# Altium schematic sheet SIM800A.SchDoc
size A4; SheetNumber: 3; SheetTotal: 6
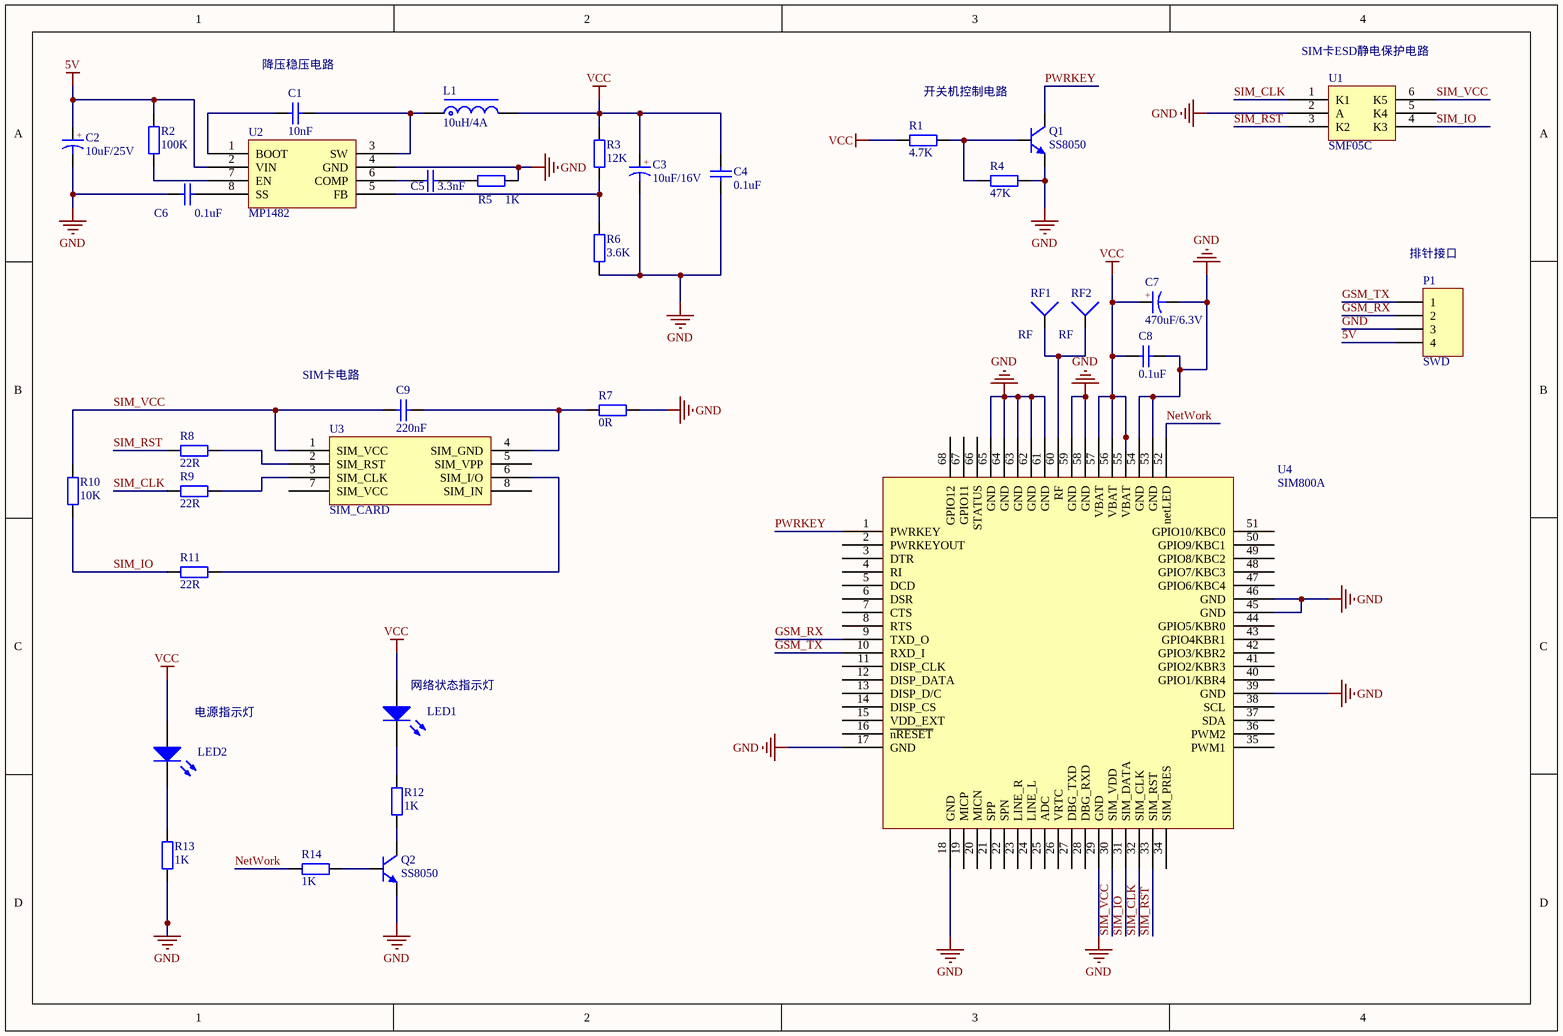
[diagram p0: SIM800A.SchDoc]

## Parts
C1  10nF  [C0805_L]
C2  10uF/25V  [CE-1.5*4*8]
C3  10uF/16V  [CE-1.5*4*8]
C4  0.1uF  [C0805_L]
C5  3.3nF  [C0805_L]
C6  0.1uF  [C0805_L]
C7  470uF/6.3V  [CE-1.5*4*8]
C8  0.1uF  [C0805_L]
C9  220nF  [C0805_L]
L1  10uH/4A  [LMR135]
LED1  红色  [LED0805_G]  (value not drawn)
LED2  红色  [LED0805_G]  (value not drawn)
P1  SWD  [HDR1X4]
Q1  SS8050  [TO92A]
Q2  SS8050  [TO92A]
R1  4.7K  [R0805_L]
R2  100K  [R0805_L]
R3  12K  [R0805_L]
R4  47K  [R0805_L]
R5  1K  [R0805_L]
R6  3.6K  [R0805_L]
R7  0R  [R0805_L]
R8  22R  [R0805_L]
R9  22R  [R0805_L]
R10  10K  [R0805_L]
R11  22R  [R0805_L]
R12  1K  [R0805_L]
R13  1K  [R0805_L]
R14  1K  [R0805_L]
RF1  RF
RF2  RF
U1  SMF05C
U2  MP1482
U3  SIM_CARD
U4  SIM800A

## Nets
5V: C2.1 P1.4 R2.2 U2.2(VIN)
GND: C2.2 C3.2 C4.1 C6.1 C7.2 C8.2 P1.3 Q1.1(E) Q2.1(E) R4.1 R5.2 R6.1 R7.1 R13.1 U1.2(A) U2.4(GND) U4.17(GND) U4.18(GND) U4.29(GND) U4.39(GND) U4.45(GND) U4.46(GND) U4.53(GND) U4.54(GND) U4.58(GND) U4.59(GND) U4.61(GND) U4.62(GND) U4.63(GND) U4.64(GND) U4.65(GND)
VCC: C3.1 C4.2 C7.1 C8.1 L1.2 LED1.1(A) LED2.1(A) R1.2 R3.2 U4.55(VBAT) U4.56(VBAT) U4.57(VBAT)
GSM_RX: P1.2 U4.9(TXD_O)
GSM_TX: P1.1 U4.10(RXD_I)
NetWork: R14.2 U4.52(netLED)
PWRKEY: Q1.3(C) U4.1(PWRKEY)
SIM_CLK: R9.2 U1.1(K1) U4.32(SIM_CLK)
SIM_IO: R10.2 R11.2 U1.4(K3) U4.31(SIM_DATA)
SIM_RST: R8.2 U1.3(K2) U4.33(SIM_RST)
SIM_VCC: C9.2 R10.1 U1.6(K5) U3.1(SIM_VCC) U4.30(SIM_VDD)
NetC1_1: C1.1 U2.1(BOOT)
NetC1_2: C1.2 L1.1 U2.3(SW)
NetC5_1: C5.1 U2.6(COMP)
NetC5_2: C5.2 R5.1
NetC6_2: C6.2 U2.8(SS)
NetC9_1: C9.1 R7.2 U3.4(SIM_GND)
NetLED1_2: LED1.2(K) R12.2
NetLED2_2: LED2.2(K) R13.2
NetQ1_2: Q1.2(B) R1.1 R4.2
NetQ2_2: Q2.2(B) R14.1
NetQ2_3: Q2.3(C) R12.1
NetR2_1: R2.1 U2.7(EN)
NetR3_1: R3.1 R6.2 U2.5(FB)
NetR8_1: R8.1 U3.2(SIM_RST)
NetR9_1: R9.1 U3.3(SIM_CLK)
NetR11_1: R11.1 U3.6(SIM_I/O)

Not connected (* = marked no-connect by the designer): U1 5(K4); U3 5(SIM_VPP) 7(SIM_VCC) 8(SIM_IN); U4 2(PWRKEYOUT) 3(DTR) 4(RI) 5(DCD) 6(DSR) 7(CTS) 8(RTS) 11(DISP_CLK) 12(DISP_DATA) 13(DISP_D/C) 14(DISP_CS) 15(VDD_EXT) 16(~{nRESET}) 19(MICP) 20(MICN) 21(SPP) 22(SPN) 23(LINE_R) 24(LINE_L) 25(ADC) 26(VRTC) 27(DBG_TXD) 28(DBG_RXD) 34(SIM_PRES) 35(PWM1) 36(PWM2) 37(SDA) 38(SCL) 40(GPIO1/KBR4) 41(GPIO2/KBR3) 42(GPIO3/KBR2) 43(GPIO4KBR1) 44(GPIO5/KBR0) 47(GPIO6/KBC4) 48(GPIO7/KBC3) 49(GPIO8/KBC2) 50(GPIO9/KBC1) 51(GPIO10/KBC0) 60(RF) 66(STATUS) 67(GPIO11) 68(GPIO12)

## Notes on the sheet
- (near C1) 降压稳压电路
- (near R1) 开关机控制电路
- (near U1) SIM卡ESD静电保护电路
- (near P1) 排针接口
- SIM卡电路
- (near LED2) 电源指示灯
- (near LED1) 网络状态指示灯
- (in symbol CE) +

## Library data of the parts
C1 C4-C6 C8 C9 = C: 贴片电容/MLCC电容; BOM名称: 无极性贴片电容; 联系下单店铺卖家 免费帮你查找封装: 联系下单店铺卖家 免费技术支持
C2 C3 C7 = CE: 直插电解电容; 联系下单店铺卖家 免费帮你查找封装: 联系下单店铺卖家 免费技术支持; BOM名称: 直插电解电容
L1 = L-MR: 功率磁环电感; 联系下单店铺卖家 免费帮你查找封装: 联系下单店铺卖家 免费技术支持; BOM名称: 功率磁环电感
LED1 LED2 = LED: 贴片LED; 封装库来自淘宝卖家：黄晶宝石: 其他店铺购入均为盗版封装库，无更新权益，退款现金奖励200~1000元; BOM名称: 贴片LED
P1 = Header 4: Header, 4-Pin; LatestRevisionDate: 17-Jul-2002; LatestRevisionNote: Re-released for DXP Platform.; Publisher: Altium Limited
Q1 Q2 = 8050-DIP: 高频放大-NPN型; 参数: 40V 1.5A 1W 100MHZ; 联系下单店铺卖家 免费帮你查找封装: 联系下单店铺卖家 免费技术支持; BOM名称: 高频放大-NPN型
R1-R14 = R: 贴片电阻; 当前库版本V2022.10.7 @黄晶宝石: 最新版本发布https://shop463601444.taobao.com; BOM名称: 贴片电阻